# Altium schematic sheet MCU.SchDoc
size A
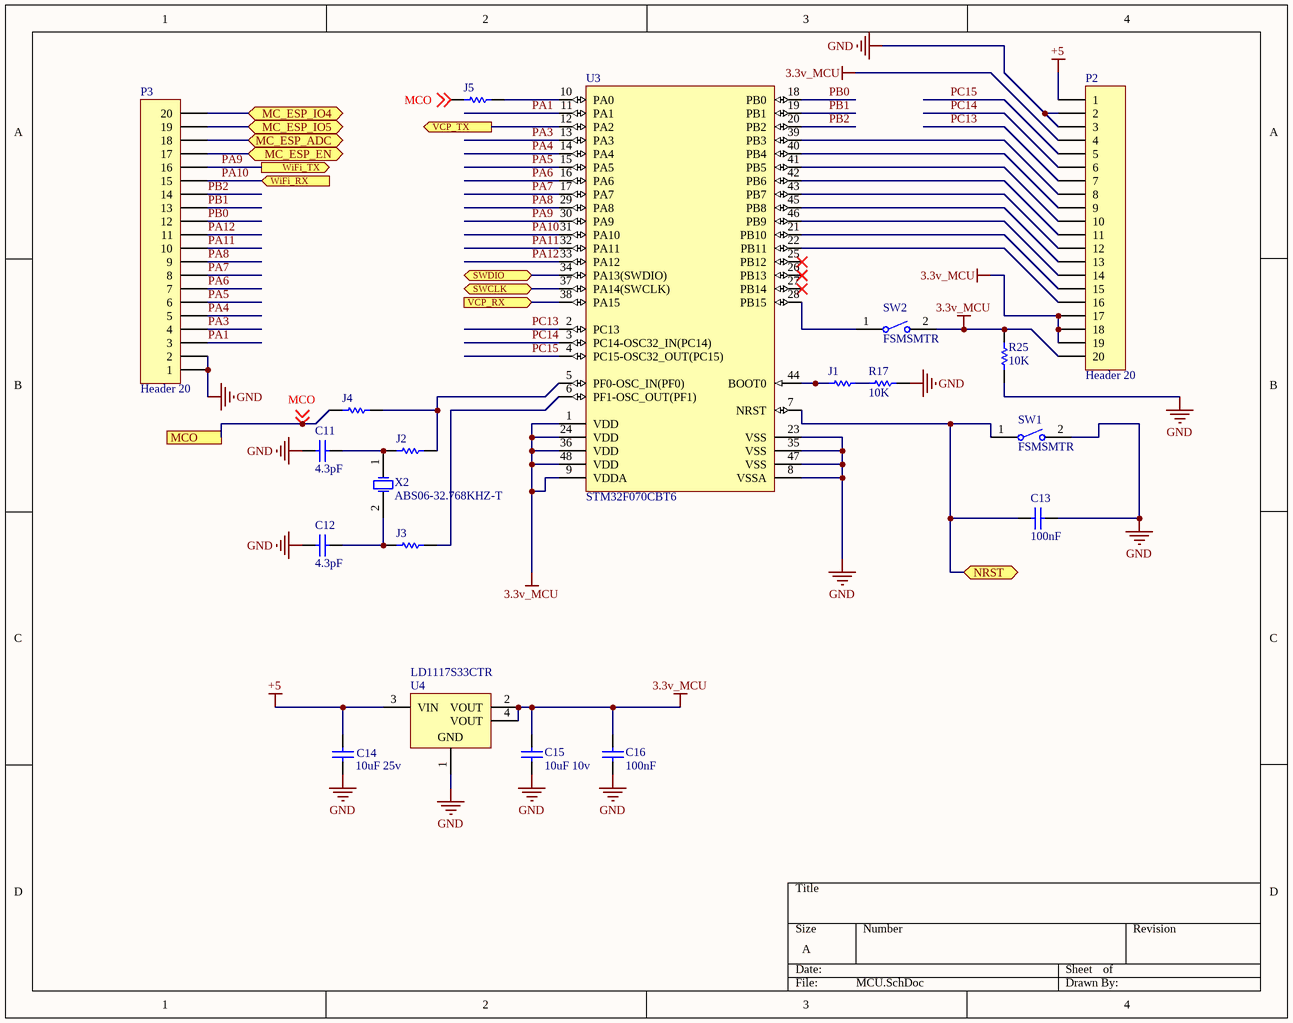
[diagram p0: MCU.SchDoc]

## Parts
C11  4.3pF  [CAPC0603(1608)100_L]
C12  4.3pF  [CAPC0603(1608)100_L]
C13  100nF  [CAPC0603(1608)100_L]
C14  10uF 25v  [CAPC0805(2012)145_L]
C15  10uF 10v  [CAPC0805(2012)145_L]
C16  100nF  [CAPC0603(1608)100_L]
J1  (no value)  [RESC1608X55X30LL10T20_A]
J2  (no value)  [RESC1608X55X30LL10T20_A]
J3  (no value)  [RESC1608X55X30LL10T20_A]
J4  (no value)  [RESC1608X55X30LL10T20_A]
J5  (no value)  [RESC1608X55X30LL10T20_A]
P2  Header 20  [HDR1X20]
P3  Header 20  [HDR1X20]
R17  10K  [RESC1609X55X30LL15T15]
R25  10K  [RESC1609X55X30LL15T15]
SW1  FSMSMTR  [TECO-FSMSMTR_V]
SW2  FSMSMTR  [TECO-FSMSMTR_V]
U3  STM32F070CBT6  [STM-LQFP48_N]
U4  LD1117S33CTR  [SOT-223_N]
X2  ABS06-32.768KHZ-T  [ABRA-ABS06-2_V]

## Ports
MC_ESP_ADC (bidir), MC_ESP_EN (bidir), MC_ESP_IO4 (bidir), MC_ESP_IO5 (bidir), MCO, NRST (bidir), SWCLK (bidir), SWDIO (bidir), VCP_RX (in), VCP_TX (out), WiFi_RX (in), WiFi_TX (out)

## Nets
3.3v_MCU: C15.2 C16.2 P2.4 P2.17 P2.18 P2.19 P2.20 R25.2 SW2.2 U3.1(VDD) U3.9(VDDA) U3.24(VDD) U3.36(VDD) U3.48(VDD) U4.2(VOUT) U4.4(VOUT)
+5: C14.2 P2.1 U4.3(VIN)
GND: C11.1 C12.1 C13.1 C14.1 C15.1 C16.1 P2.2 P2.3 P3.1 P3.2 R17.2 R25.1 SW1.2 U3.8(VSSA) U3.23(VSS) U3.35(VSS) U3.47(VSS) U4.1(GND)
MC_ESP_ADC: P3.18 ; port MC_ESP_ADC
MC_ESP_EN: P3.17 ; port MC_ESP_EN
MC_ESP_IO4: P3.20 ; port MC_ESP_IO4
MC_ESP_IO5: P3.19 ; port MC_ESP_IO5
MCO: J4.1 J5.1 ; off-sheet MCO, port MCO
NRST: C13.2 SW1.1 U3.7(NRST) ; port NRST
PA1: P3.3 U3.11(PA1)
PA3: P3.4 U3.13(PA3)
PA4: P3.5 U3.14(PA4)
PA5: P3.6 U3.15(PA5)
PA6: P3.7 U3.16(PA6)
PA7: P3.8 U3.17(PA7)
PA8: P3.9 U3.29(PA8)
PA9: P3.16 U3.30(PA9) ; port WiFi_TX
PA10: P3.15 U3.31(PA10) ; port WiFi_RX
PA11: P3.10 U3.32(PA11)
PA12: P3.11 U3.33(PA12)
PB0: P3.12 U3.18(PB0)
PB1: P3.13 U3.19(PB1)
PB2: P3.14 U3.20(PB2)
PC13: P2.7 U3.2(PC13)
PC14: P2.6 U3.3(PC14-OSC32_IN(PC14))
PC15: P2.5 U3.4(PC15-OSC32_OUT(PC15))
SWCLK: U3.37(PA14(SWCLK)) ; port SWCLK
SWDIO: U3.34(PA13(SWDIO)) ; port SWDIO
VCP_RX: U3.38(PA15) ; port VCP_RX
VCP_TX: U3.12(PA2) ; port VCP_TX
NetC11_2: C11.2 J2.1 X2.1(X1)
NetC12_2: C12.2 J3.1 X2.2(X2)
NetJ1_1: J1.1 U3.44(BOOT0)
NetJ1_2: J1.2 R17.1
NetJ2_2: J2.2 J4.2 U3.5(PF0-OSC_IN(PF0))
NetJ3_2: J3.2 U3.6(PF1-OSC_OUT(PF1))
NetJ5_2: J5.2 U3.10(PA0)
NetP2_8: P2.8 U3.39(PB3)
NetP2_9: P2.9 U3.40(PB4)
NetP2_10: P2.10 U3.41(PB5)
NetP2_11: P2.11 U3.42(PB6)
NetP2_12: P2.12 U3.43(PB7)
NetP2_13: P2.13 U3.45(PB8)
NetP2_14: P2.14 U3.46(PB9)
NetP2_15: P2.15 U3.21(PB10)
NetP2_16: P2.16 U3.22(PB11)
NetSW2_1: SW2.1 U3.28(PB15)

Not connected (* = marked no-connect by the designer): U3 25(PB12)* 26(PB13)* 27(PB14)*

## Library data of the parts
C11 C12 = CMP-1035-00303-1: CAP 4.3pF 25V ±0.5pF 0603 (1608 Metric) Thickness 1mm SMD; Case-EIA: 0603; Tolerance: Â±0.5pF; Case-Metric: 1608; Value: 4.3pF; Technology: SMT; Max Thickness: 1 mm; Rated Voltage: 25 V
C13 C16 = CMP-1035-02583-1: CAP 100nF 16V ±5% 0603 (1608 Metric) Thickness 1mm SMD; Tolerance: Â±5%; Case-Metric: 1608; Case-EIA: 0603; Rated Voltage: 16 V; Max Thickness: 1 mm; Technology: SMT; Value: 100nF
C14 = CMP-1036-04932-1: CAP 10uF 25V ±10% 0805 (2012 Metric) Thickness 1.45mm SMD; Case-EIA: 0805; Case-Metric: 2012; Tolerance: Â±10%; Technology: SMT; Value: 10uF; Rated Voltage: 25 V; Max Thickness: 1.45 mm
C15 = CMP-1036-04926-1: CAP 10uF 10V -20% to +80% 0805 (2012 Metric) Thickness 1.45mm SMD; Case-EIA: 0805; Case-Metric: 2012; Technology: SMT; Max Thickness: 1.45 mm; Rated Voltage: 10 V; Value: 10uF; Tolerance: -20% to +80%
J1-J5 = CMP-2000-06686-1: Chip Resistor, 0 Ohm, +/- 5%, 100 mW, -55 to 155 degC, 0603 (1608 Metric), RoHS, Tape and Reel; Manufacturer: Rohm; Tolerance: Jumper; Power (Watts): 0.1W,1/10W; Resistance (Ohms): 0.0; Online Catalog: MCR03Series; EDA / CAD Models: DownloadfromAcceleratedDesigns; Other Names: RHM0.0CGTR; Series: MCR; Package Description: 2-Pin Surface Mount Device, Body 1.60 x 0.80 mm; Composition: ThickFilm; Height: 0.022"(0.55mm); Mounting Technology: SurfaceMount; Family: ChipResistor-SurfaceMount; Temperature Coefficient: -; Category: Resistors; Supplier Device Package: 0603(1608Metric); Package Reference: 0603; Size / Dimension: 0.063"Lx0.031"W(1.60mmx0.80mm); Standard Package: 5,000; Datasheet URL: http://www.rohm.com/web/global/datasheet/MCR03ERTJ; Features: -; Datasheet Version: Rev. F, 02/2015; Operating Temperature: -55°C~155°C; Package / Case: 0603(1608Metric); Manufacturer URL: http://www.rohm.com/web/global/; Packaging: Tape&Reel(TR); Number of Terminations: 2
P2 P3 = Header 20: Header, 20-Pin; LatestRevisionDate: 17-Jul-2002; LatestRevisionNote: Re-released for DXP Platform.; Publisher: Altium Limited
R17 R25 = CMP-2000-07452-1: Chip Resistor, 10 KOhm, +/- 1%, 0.1 W, -55 to 155 degC, 0603 (1608 Metric), RoHS, Tape and Reel; Manufacturer: Panasonic; Voltage Rating: 75V; Case\/Package: 0603; Power Rating: 100mW; Resistance: 10KOhm; Temperature Coefficient: 100ppm\/degreesC; Number of Pins: 2; Package Reference: 603; Depth: 0.8mm; Mount: SurfaceMount; Package Description: 2-Pin Surface Mount Device, Body 1.6 x 0.85 mm; Datasheet Version: 02/2017; Length: 1.6mm; Lead Free: LeadFree; Height: 0.45mm; Number of Terminations: 2; Max Power Dissipation: 100mW; Min Operating Temperature: -55degC; Datasheet URL: https://industrial.panasonic.com/cdbs/www-data/pdf/RDA0000/AOA0000C304.pdf; Termination: SMD/SMT; Case Code (Metric): 1608; Case Code (Imperial): 0603; Tolerance: 1%; Max Operating Temperature: 155degC; RoHSCompliant: true; Voltage Rating (DC): 75V; Radiation Hardening: No; Packaging: TapeandReel; Composition: ThickFilm; Mounting Technology: SurfaceMount; Manufacturer URL: http://www.panasonic.com/; Width: 0.031inch; REACH SVHC: NoSVHC; Contact Plating: Tin; Military Standard: Not; Package Quantity: 1
SW1 SW2 = CMP-2000-07501-1: FSMSM Push Button Switch, 50 mA, -35 to 85 degC, 2-Pin SMD, RoHS, Tape and Reel; Manufacturer: TE Connectivity; Voltage Rating (DC): 24V; Electrical Life: 20000Cycles; Operating Force: 180gf; Switch Travel: 0.25mm; Contact Current Rating: 50mA; Case\/Package: SMD/SMT; Actuator Length: 1.07mm; Throw Configuration: SPST; Actuator Material: Polyamide; Contact Resistance: 100mOhm; Illumination Type: Illuminated; Max Voltage Rating (DC): 12V; Manufacturer URL: http://www.te.com/; Lead Free: LeadFree; Packaging: TapeandReel; Min Operating Temperature: -35degC; Mechanical Life: 20000Cycles; Mount: SurfaceMount; REACH SVHC: Unknown; Package Quantity: 1800; Package Reference: FSMSMTR; RoHSCompliant: true; Max Operating Temperature: 85degC; Orientation: Straight; ELV: Compliant; Datasheet URL: http://www.te.com/commerce/DocumentDelivery/DDEController?Action=showdoc&DocId=Customer+Drawing%7F1437566-3%7FC2%7Fpdf%7FEnglish%7FENG_CD_1437566-3_C2_1437566_3_1_c.dwg.pdf%7F1437566-4; Package Description: 2-Pin Surface Mount Device, Body 6 x 3.5 mm, Pitch 9.19 mm; Current Rating: 50mA; Contact Plating: Silver; Termination: GullWing; Datasheet Version: Rev. C2, 08/2014; Contact Material: Brass; Mounting Technology: SurfaceMount
U3 = CMP-0304-00143-1: ARM Cortex-M0 32-bit MCU, 128 KB Flash, 16 KB Internal RAM, 37 I/Os, 48-Pin LQFP, -40 to 85 degC, Tray; I/Os (High Current): 37; FLASH Size (Prog) (kB): 128; Operating Frequency(F) (Processor speed) (MHz): 48; Internal RAM Size (kB): 16; Supply Voltage(Vcc) min (V): 2.4; Package Description: 48-Pin Low Profile Quad Flat Package, Body 7 x 7 mm, Pitch 0.5 mm; Mounting Technology: Surface Mount; DatasheetVersion: Rev. 3; ComponentLink1Description: Manufacturer URL; Package Reference: LQFP48; Core: ARM Cortex-M0; ComponentLink1URL: http://www.st.com/; Packing: Tray; ComponentLink2Description: Datasheet; ComponentLink2URL: http://www.st.com/st-web-ui/static/active/en/resource/technical/document/datasheet/DM00141386.pdf
U4 = CMP-0244-00307-1: Fixed Low Drop Positive Voltage Regulator, 3.3V, 4-Pin SOT-223, Tape and Reel; ComponentLink1URL: http://www.st.com; PackageVersion: 2010; ComponentLink1Description: Manufacturer URL; DatasheetVersion: 1/11/2011; ComponentLink2URL: http://www.st.com/internet/com/TECHNICAL_RESOURCES/TECHNICAL_LITERATURE/DATASHEET/CD00000544.pdf; PackageReference: SOT-223; ComponentLink2Description: Datasheet; PackageDescription: 4-Pin SOT-223 Package, 6.5 x 3.5 mm Body, 2.3 mm Pitch, 7 mm Lead Span
X2 = CMP-2000-05035-1: Low Profile Crystal, 32.768 KHz, -40 to 85 degC, 2-Pin SMD, RoHS, Tape and Reel; Brand: ABRACON; Tolerance: 20PPM; Case Height: 0.6mm; Case Length: 2mm; Case Width: 1.2mm; ESR: 90kOhms; Load Capacitance: 12.5pF; Series: ABS06; Manufacturer URL: http://www.abracon.com/; RoHS: Details; Datasheet URL: http://www.mouser.com/ds/2/3/ABS06-10798.pdf; Package / Case: 2-SMD; Mounting Style: SMD/SMT; Type: LowProfileCrystal; Product Category: Crystals; Datasheet Version: Sep-15; Frequency Stability: 20PPM; Packaging: Reel; Frequency: 32.768kHz; Operating Temperature Range: -40Cto+85C; Package Description: 2-Pin Surface Mounted Device, Body 2 x 1.2 mm, Height 0.6 mm; Dimensions: 1.2mmWx2mmLx0.6mmH; Package Reference: ABS06; Manufacturer: ABRACON; Termination Style: SMD/SMT; Factory Pack Quantity: 3000